# EAGLE design M307-9601 (EAGLE 6.6.0)
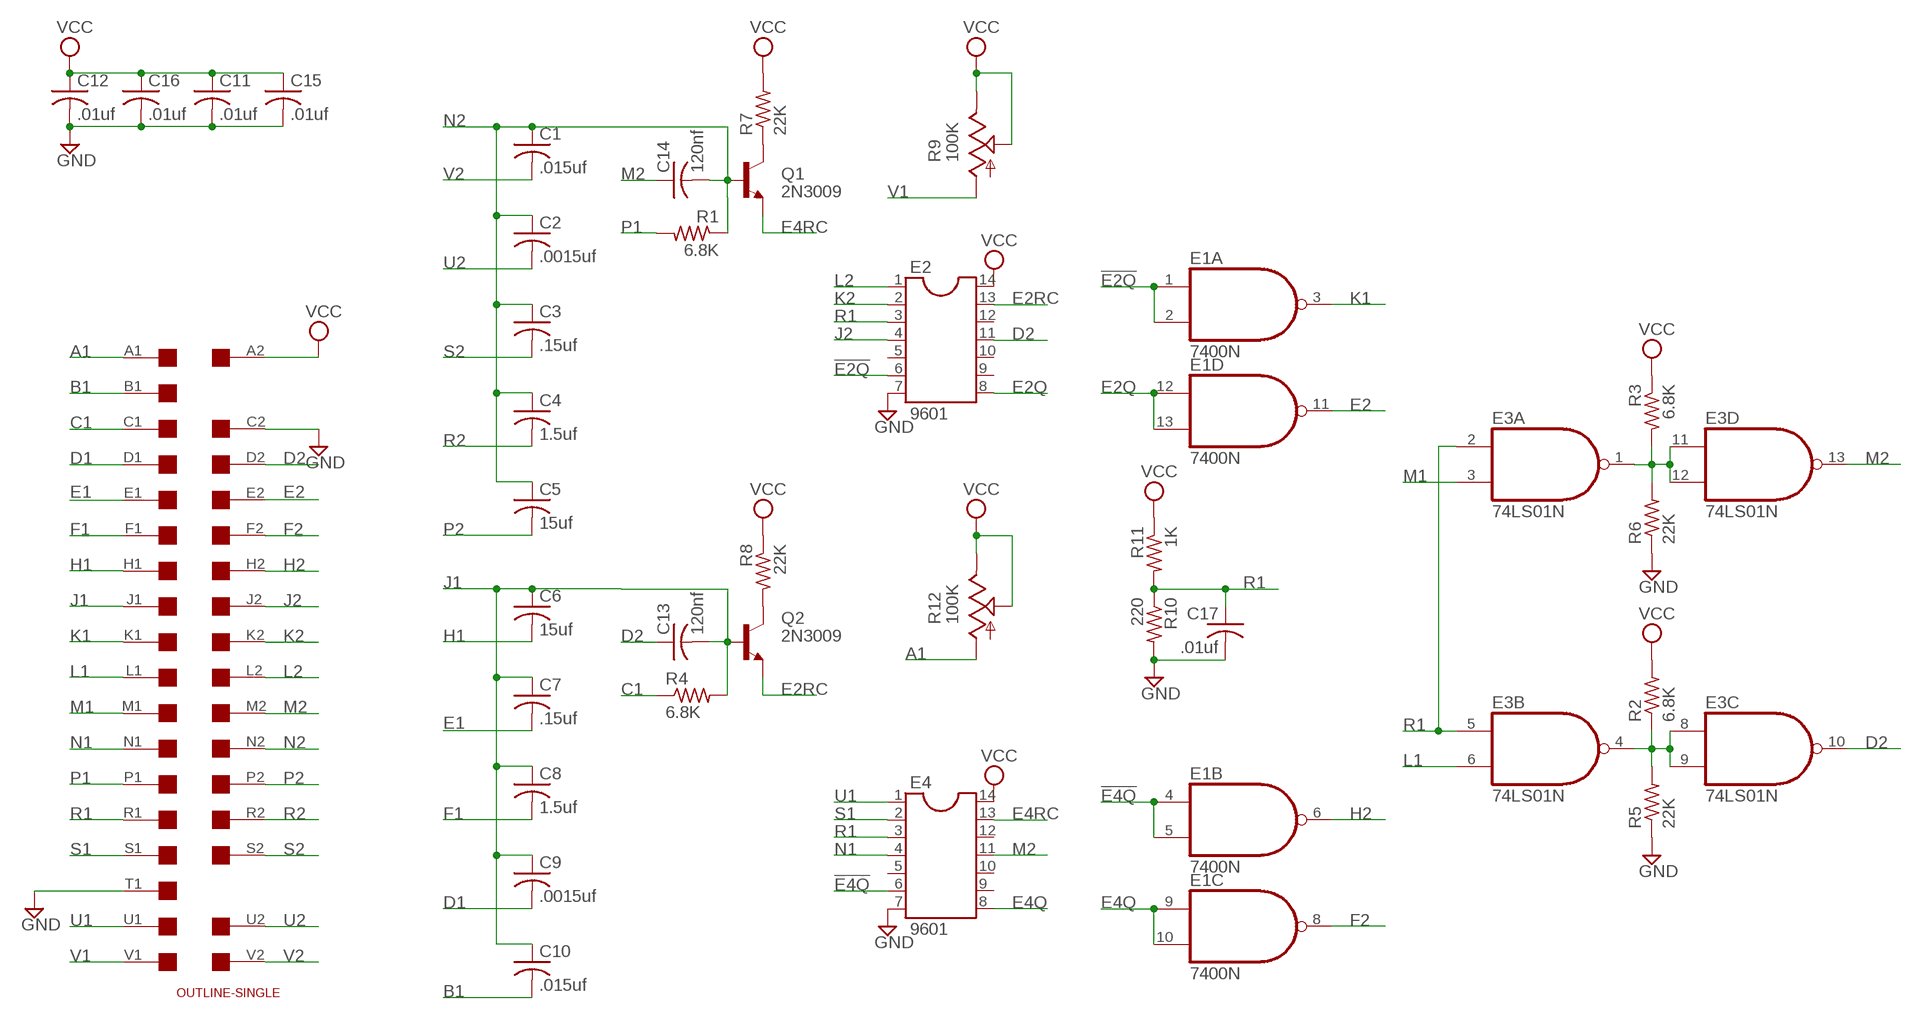
[diagram p0: schematic, sheet 1]

## Parts
C1  .015uf  C-US150-054X183  [C150-054X183]
C2  .0015uf  C-US050-025X075  [C050-025X075]
C3  .15uf  C-US102-043X133  [C102-043X133]
C4  1.5uf  C-US150-054X183  [C150-054X183]
C5  15uf  C-US150-054X183  [C150-054X183]
C6  15uf  C-US150-054X183  [C150-054X183]
C7  .15uf  C-US102-043X133  [C102-043X133]
C8  1.5uf  C-US150-054X183  [C150-054X183]
C9  .0015uf  C-US050-025X075  [C050-025X075]
C10  .015uf  C-US150-054X183  [C150-054X183]
C11  .01uf  C-US050-025X075  [C050-025X075]
C12  .01uf  C-US050-025X075  [C050-025X075]
C13  120nf  C-US075-032X103  [C075-032X103]
C14  120nf  C-US075-032X103  [C075-032X103]
C15  .01uf  C-US050-025X075  [C050-025X075]
C16  .01uf  C-US050-025X075  [C050-025X075]
C17  .01uf  C-US050-025X075  [C050-025X075]
E1  7400N  [DIL14]
E2  9601  DIL14  [DIL14]
E3  74LS01N  [DIL14]
E4  9601  DIL14  [DIL14]
Q1  2N3009  2N3019-NPN-TO39-EBC  [TO39]
Q2  2N3009  2N3019-NPN-TO39-EBC  [TO39]
R1  6.8K  R-US_0207/10  [0207/10]
R2  6.8K  R-US_0207/10  [0207/10]
R3  6.8K  R-US_0207/10  [0207/10]
R4  6.8K  R-US_0207/10  [0207/10]
R5  22K  R-US_0207/10  [0207/10]
R6  22K  R-US_0207/10  [0207/10]
R7  22K  R-US_0207/10  [0207/10]
R8  22K  R-US_0207/10  [0207/10]
R9  100K  TRIM_US-PTSPIN  [PT-SPIN]
R10  220  R-US_0207/10  [0207/10]
R11  1K  R-US_0207/10  [0207/10]
R12  100K  TRIM_US-PTSPIN  [PT-SPIN]
U$1  OUTLINE-SINGLE  [SINGLE]
U$4  SINGLE  [EDGE-CON2]

## Nets
!E2Q: E1.1(A:I0) E1.2(A:I1) E2.6
!E4Q: E1.4(B:I0) E1.5(B:I1) E4.6
A1: R12.A U$4.A1
B1: C10.2 U$4.B1
C1: R4.1 U$4.C1
D1: C9.2 U$4.D1
D2: C13.1 E2.11 E3.10(C:O) U$4.D2
E1: C7.2 U$4.E1
E2: E1.11(D:O) U$4.E2
E2Q: E1.12(D:I0) E1.13(D:I1) E2.8
E2RC: E2.13 Q2.1(E)
E4Q: E1.9(C:I0) E1.10(C:I1) E4.8
E4RC: E4.13 Q1.1(E)
F1: C8.2 U$4.F1
F2: E1.8(C:O) U$4.F2
GND [power]: C11.2 C12.2 C15.2 C16.2 C17.2 E2.7 E4.7 R5.1 R6.1 R10.2 U$4.C2 U$4.T1
H1: C6.2 U$4.H1
H2: E1.6(B:O) U$4.H2
J1: C6.1 C7.1 C8.1 C9.1 C10.1 C13.2 Q2.2(B) R4.2 U$4.J1
J2: E2.4 U$4.J2
K1: E1.3(A:O) U$4.K1
K2: E2.2 U$4.K2
L1: E3.6(B:I1) U$4.L1
L2: E2.1 U$4.L2
M1: E3.3(A:I1) U$4.M1
M2: C14.1 E3.13(D:O) E4.11 U$4.M2
N1: E4.4 U$4.N1
N2: C1.1 C2.1 C3.1 C4.1 C5.1 C14.2 Q1.2(B) R1.1 U$4.N2
N$1: Q1.3(C) R7.1
N$2: E3.4(B:O) E3.8(C:I0) E3.9(C:I1) R2.1 R5.2
N$3: Q2.3(C) R8.2
N$5: E3.1(A:O) E3.11(D:I0) E3.12(D:I1) R3.2 R6.2
P1: R1.2 U$4.P1
P2: C5.2 U$4.P2
R1: C17.1 E2.3 E3.2(A:I0) E3.5(B:I0) E4.3 R10.1 R11.2 U$4.R1
R2: C4.2 U$4.R2
S1: E4.2 U$4.S1
S2: C3.2 U$4.S2
U1: E4.1 U$4.U1
U2: C2.2 U$4.U2
V1: R9.A U$4.V1
V2: C1.2 U$4.V2
VCC [power]: C11.1 C12.1 C15.1 C16.1 E2.14 E4.14 R2.2 R3.1 R7.2 R8.1 R9.E R9.S R11.1 R12.E R12.S U$4.A2
Unconnected: E2.5 E2.9 E2.10 E2.12 E4.5 E4.9 E4.10 E4.12 U$4.B2 U$4.T2

## Power pins joined to a net without a drawn wire
GND: E1.7(P:GND) E3.7(P:GND)
VCC: E1.14(P:VCC) E3.14(P:VCC)

## Library data of the parts
C1-C17 = rcl:C-US: CAPACITOR, American symbol
E1 = 74xx-us:74*00: Quad 2-input NAND gate
E2 E4 = ic-package:DIL14: Dual In Line / Socket
E3 = 74xx-us:74*01: Quad 2-input NAND gate, open collector
Q1 Q2 = transistor:*-NPN-: NPN Transistror BF959 corrected 2008.03.06
R1-R8 R10 R11 = rcl:R-US_: RESISTOR, American symbol
R9 R12 = pot:TRIM_US-: POTENTIOMETER
U$1 = dec-con:OUTLINE-*: Board outlines for DEC boards.
U$4 = dec-con:SINGLE: Single-Height DEC board

## Net classes
1 power: width 0.508 mm, clearance 0.508 mm

## Board
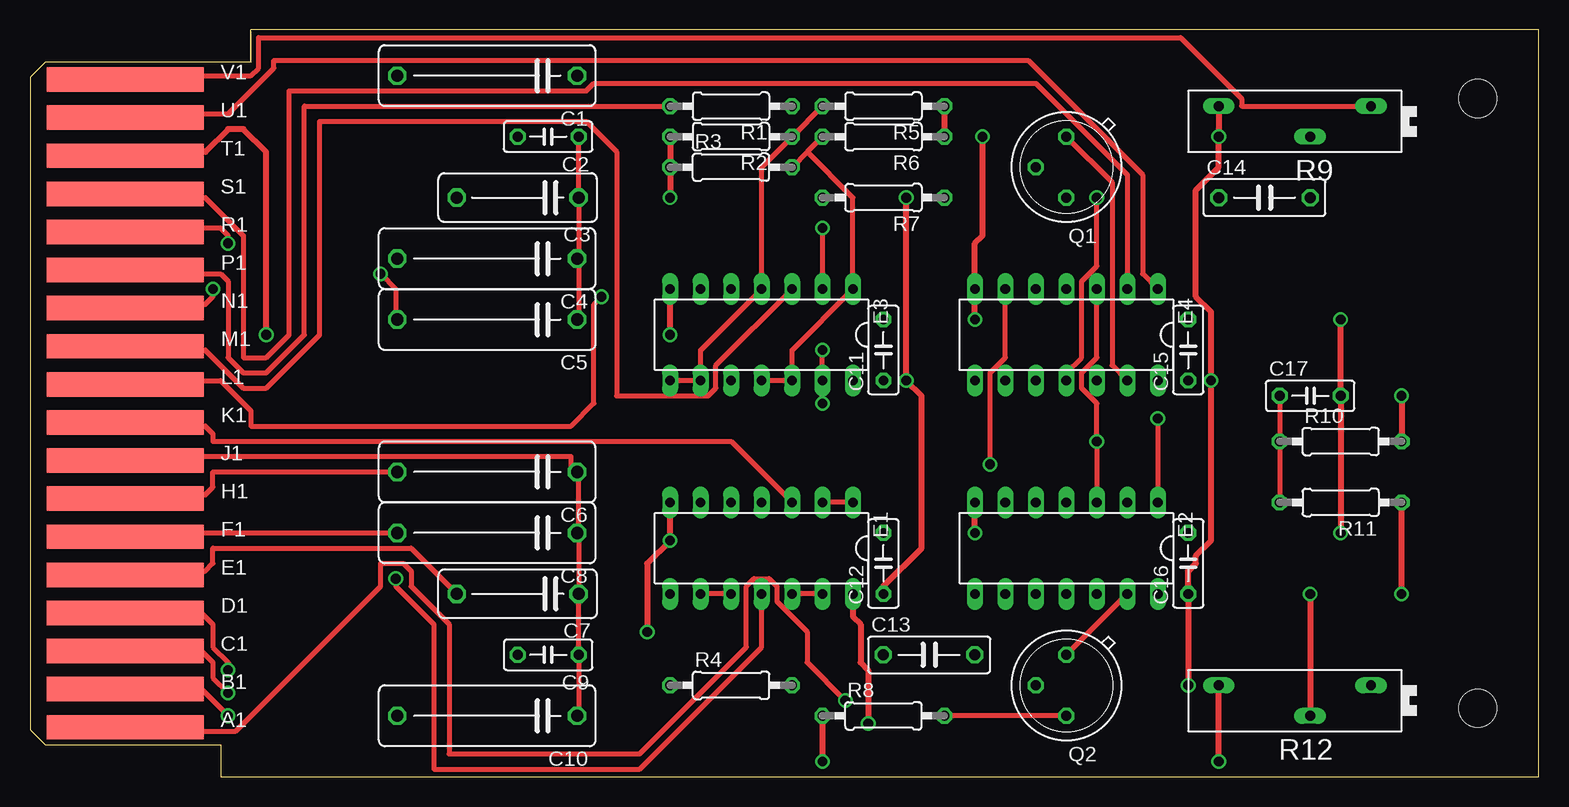
[diagram p1: board, top side]
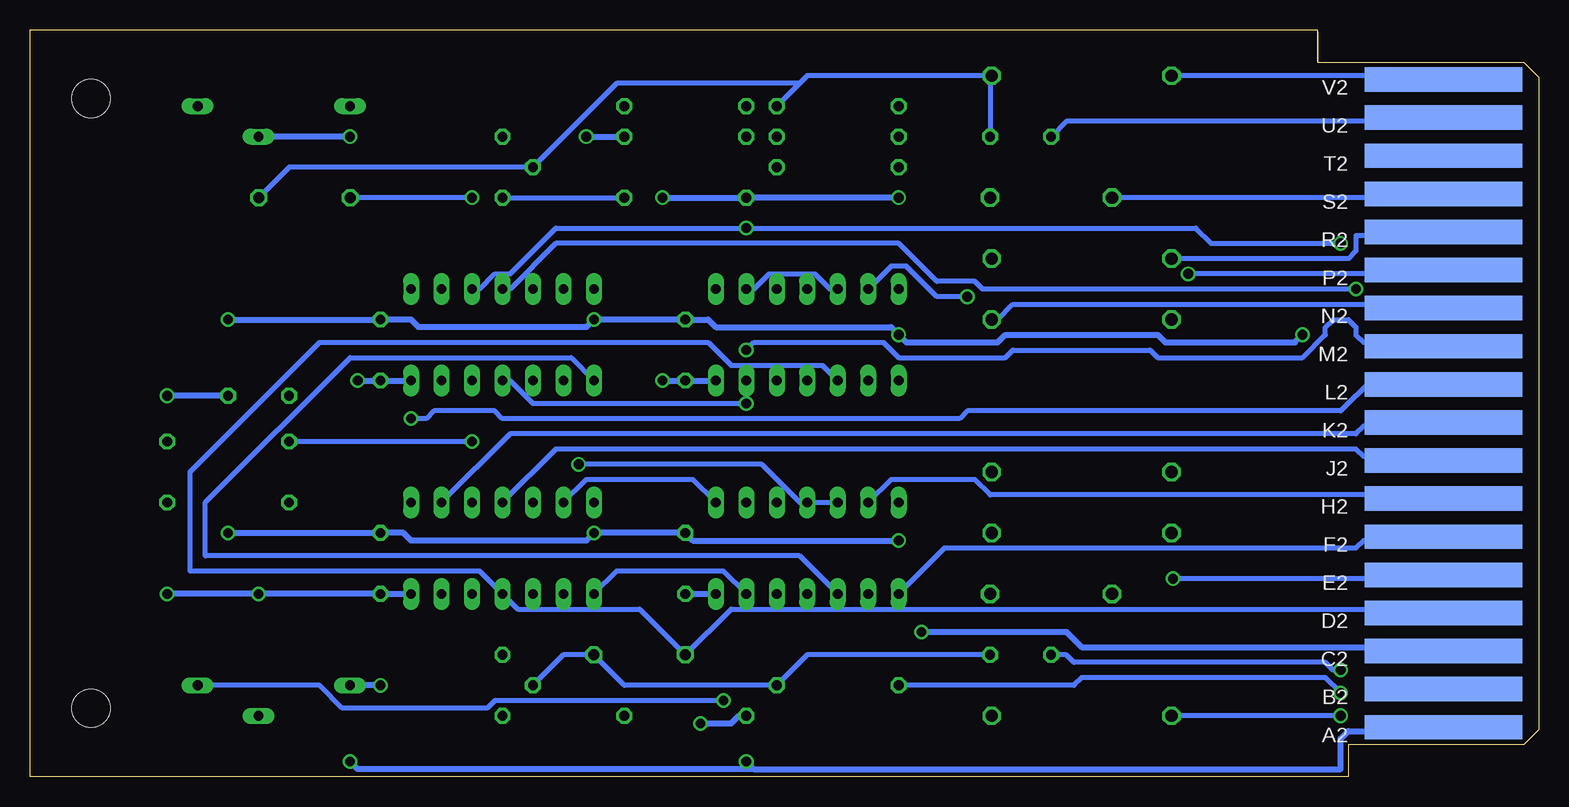
[diagram p2: board, bottom side, seen from below]

Size 125.73 x 62.23 mm. Coordinates in mm from the lower left corner, seen from the top.
Copper layers (1+16): Top 0.035mm / dielectric 1.5mm / Bottom 0.035mm
Design rules "16mils": minimum track width 16mil, minimum drill 32mil, track to track 15mil, track to pad 10mil, pad to pad 10mil, via to via 10mil, smd to smd 10mil, copper to edge 13mil, drill to drill 10mil, minimum pad ring 10mil, minimum via ring 8mil, stop-mask expansion 0mil, vias tented up to drill 0mil, thermal gap 10mil

### Footprints (pad centres in the part's own frame; a part is rotated, then mirrored left to right if it is on the bottom)
C150-054X183 = drill 1.016 octagon: 1 -7.493,0; 2 7.493,0
C050-025X075 = drill 0.813 octagon: 1 -2.54,0; 2 2.54,0
C102-043X133 = drill 1.016 octagon: 1 -5.08,0; 2 5.08,0
C075-032X103 = drill 0.914 octagon: 1 -3.81,0; 2 3.81,0
DIL14 = drill 0.813 long: 1 -7.62,-3.81; 2 -5.08,-3.81; 3 -2.54,-3.81; 4 0,-3.81; 5 2.54,-3.81; 6 5.08,-3.81; 7 7.62,-3.81; 8 7.62,3.81; 9 5.08,3.81; 10 2.54,3.81; 11 0,3.81; 12 -2.54,3.81; 13 -5.08,3.81; 14 -7.62,3.81
TO39 = drill 0.813 octagon: 1 0,-2.54; 2 2.54,0; 3 0,2.54
0207/10 = drill 0.813 octagon: 1 -5.08,0; 2 5.08,0
PT-SPIN = drill 0.813 long: A -6.35,-1.27; E 6.35,-1.27; S -1.27,1.27
SINGLE = hole 3.175: 120.65,56.515; 120.65,5.715
EDGE-CON2 = smd 13.106 x 2.032: A1 7.938,4.128; B1 7.938,7.303; C1 7.938,10.477; D1 7.938,13.652; E1 7.938,16.828; F1 7.938,20.003; H1 7.938,23.177; J1 7.938,26.352; K1 7.938,29.527; L1 7.938,32.703; M1 7.938,35.877; N1 7.938,39.053; P1 7.938,42.227; R1 7.938,45.403; S1 7.938,48.578; T1 7.938,51.752; U1 7.938,54.928; V1 7.938,58.102 | smd 13.106 x 2.032 bottom: A2 7.938,4.128; B2 7.938,7.303; C2 7.938,10.477; D2 7.938,13.652; E2 7.938,16.828; F2 7.938,20.003; H2 7.938,23.177; J2 7.938,26.352; K2 7.938,29.527; L2 7.938,32.703; M2 7.938,35.877; N2 7.938,39.053; P2 7.938,42.227; R2 7.938,45.403; S2 7.938,48.578; T2 7.938,51.752; U2 7.938,54.928; V2 7.938,58.102

### Placement (x,y rotation side)
C1  38.1,58.42 180 top
C2  43.18,53.34 180 top
C3  40.64,48.26 180 top
C4  38.1,43.18 180 top
C5  38.1,38.1 180 top
C6  38.1,25.4 180 top
C7  40.64,15.24 180 top
C8  38.1,20.32 180 top
C9  43.18,10.16 180 top
C10  38.1,5.08 180 top
C11  71.12,35.56 90 top
C12  71.12,17.78 90 top
C13  74.93,10.16 0 top
C14  102.87,48.26 0 top
C15  96.52,35.56 90 top
C16  96.52,17.78 90 top
C17  106.68,31.75 0 top
E1  60.96,19.05 180 top
E2  86.36,19.05 180 top
E3  60.96,36.83 180 top
E4  86.36,36.83 180 top
Q1  86.36,50.8 180 top
Q2  86.36,7.62 180 top
R1  58.42,55.88 180 top
R2  58.42,53.34 180 top
R3  58.42,50.8 0 top
R4  58.42,7.62 0 top
R5  71.12,55.88 180 top
R6  71.12,53.34 180 top
R7  71.12,48.26 180 top
R8  71.12,5.08 0 top
R9  105.41,54.61 180 top
R10  109.22,27.94 0 top
R11  109.22,22.86 180 top
R12  105.41,6.35 180 top
U$1  0,0 0 top
U$4  0,0 0 top

### Tracks (layer width: path | path; a pad name or v marks a point on that pad's centre or on a via)
!E2Q
  Top 0.406: E1.1 E1.2
  Bottom 0.406: E2.6 79.38,24.77 70.49,24.77 E1.1
!E4Q  (via drill 0.81)
  Top 0.406: E4.6 81.28,34.92 80.01,33.66 v80.01,26.04
  Bottom 0.406: E1.5 E1.4 61.6,22.86 64.77,26.04 v80.01,26.04
A1  (via drill 0.81)
  Top 0.406: v67.95,6.35 64.77,9.53 64.77,12.06 62.23,14.61 62.23,15.88 61.6,16.51 60.33,16.51 59.69,15.88 59.69,10.79 50.8,1.91 34.93,1.91 34.93,12.7 31.75,15.88 31.75,17.14 31.12,17.78 29.21,17.78 29.21,15.88 17.15,3.81 9.53,3.81 8.89,4.45 8.26,4.45 U$4.A1
  Bottom 0.406: R12.A 101.6,7.62 99.7,5.71 87.63,5.71 87,6.35 v67.95,6.35
B1  (via drill 0.81)
  Top 0.406: v16.51,5.08 13.97,7.62 8.26,7.62 U$4.B1
  Bottom 0.406: v16.51,5.08 C10.2
C1  (via drill 0.81)
  Top 0.406: v16.51,6.99 15.24,8.26 15.24,9.53 13.97,10.79 8.26,10.79 U$4.C1
  Bottom 0.406: R4.1 38.74,7.62 38.1,8.26 17.78,8.26 v16.51,6.99
D1  (via drill 0.81)
  Top 0.406: v16.51,8.89 16.51,9.53 15.24,10.79 15.24,12.7 13.97,13.97 8.26,13.97 U$4.D1
  Bottom 0.406: C9.2 39.37,10.16 38.74,9.53 17.78,9.53 17.15,8.89 v16.51,8.89
D2
  Bottom 0.406: E3.10 59.69,34.29 67.31,34.29 69.22,36.2 101.6,36.2 112.4,25.4 112.4,17.14 88.27,17.14 E2.11 85.09,13.97 74.93,13.97 C13.1 67.31,13.97 8.26,13.97 U$4.D2
E1
  Top 0.406: C7.2 31.75,19.05 15.24,19.05 15.24,17.78 14.61,17.14 8.26,17.14 U$4.E1
E2  (via drill 0.81)
  Top 0.406: E1.11 60.96,10.79 50.8,0.64 33.66,0.64 33.66,12.7 30.48,15.88 v30.48,16.51
  Bottom 0.406: v30.48,16.51 12.07,16.51 11.43,17.14 8.26,17.14 U$4.E2
E2Q
  Top 0.406: E1.13 E1.12
  Bottom 0.406: E2.8 76.84,17.14 67.95,17.14 E1.13
E2RC
  Top 0.406: E2.13 Q2.1
E4Q
  Top 0.406: E1.10 E1.9
  Bottom 0.406: E4.8 80.65,34.92 99.06,34.92 111.13,22.86 111.13,18.41 61.6,18.41 E1.10
E4RC
  Top 0.406: E4.13 90.17,34.29 90.17,49.53 Q1.1
F1
  Top 0.406: C8.2 8.26,20.32 U$4.F1
F2
  Bottom 0.406: E1.8 49.53,19.05 15.24,19.05 14.61,19.68 8.26,19.68 U$4.F2
GND  (via drill 0.81)
  Top 0.508: E1.7 v53.34,19.68 51.44,17.78 v51.44,12.06 | v78.74,20.32 E2.7 | v114.3,31.75 R10.2 | v109.22,38.1 C17.2 v109.22,20.32 | R5.1 R6.1 | v78.74,38.1 E4.7 78.74,44.45 79.38,45.09 v79.38,53.34 | v53.34,36.83 E3.7 | v19.69,36.83 19.69,52.07 17.78,53.98 16.51,53.98 14.61,52.07 8.26,52.07 U$4.T1
  Bottom 0.508: v53.34,19.68 70.49,19.68 C12.2 v78.74,20.32 79.38,19.68 93.98,19.68 94.62,20.32 C16.2 v109.22,20.32 | v51.44,12.06 39.37,12.06 38.1,10.79 8.26,10.79 U$4.C2 | C17.2 v114.3,31.75 | v109.22,38.1 C15.2 93.98,38.1 93.35,37.47 79.38,37.47 v78.74,38.1 C11.2 69.22,38.1 68.58,37.47 53.98,37.47 v53.34,36.83 52.71,36.2 45.09,36.2 44.45,36.83 31.75,36.83 31.12,36.2 20.32,36.2 v19.69,36.83 | v79.38,53.34 R6.1
H1
  Top 0.406: C6.2 15.24,25.4 15.24,24.13 14.61,23.5 8.26,23.5 U$4.H1
H2
  Bottom 0.406: E1.6 53.98,24.77 46.99,24.77 45.72,23.5 8.26,23.5 U$4.H2
J1
  Top 0.406: 45.72,20.32 C7.1 C9.1 45.72,5.08 C10.1 | 45.72,20.32 45.72,25.4 C6.1 45.09,25.4 45.09,26.67 8.26,26.67 U$4.J1 | 45.72,20.32 C8.1
  Bottom 0.406: Q2.2 81.28,10.16 C13.2 76.2,7.62 R4.2 60.96,10.16 C9.1
J2
  Bottom 0.406: E2.4 81.92,27.3 15.24,27.3 14.61,26.67 8.26,26.67 U$4.J2
K1
  Top 0.406: E1.3 58.42,27.94 15.24,27.94 15.24,28.57 14.61,29.21 8.26,29.21 U$4.K1
K2
  Bottom 0.406: E2.2 85.73,28.57 15.24,28.57 14.61,29.21 8.26,29.21 U$4.K2
L1  (via drill 0.81)
  Top 0.406: v47.63,40.01 46.99,39.37 46.99,31.11 45.09,29.21 18.42,29.21 18.42,30.48 15.88,33.02 8.26,33.02 U$4.L1
  Bottom 0.406: E3.6 53.98,42.55 52.71,42.55 50.17,40.01 v47.63,40.01
L2  (via drill 0.81)
  Top 0.406: v93.98,29.84 E2.1
  Bottom 0.406: v93.98,29.84 92.71,29.84 92.08,30.48 87,30.48 86.36,29.84 48.26,29.84 47.63,30.48 16.51,30.48 13.97,33.02 8.26,33.02 U$4.L2
M1
  Top 0.406: E3.3 57.15,34.29 57.15,32.38 56.52,31.75 48.9,31.75 48.9,52.07 46.36,54.61 24.13,54.61 24.13,36.83 19.69,32.38 17.78,32.38 14.61,35.56 8.26,35.56 U$4.M1
M2  (via drill 0.81)
  Top 0.406: v66.04,31.11 E3.13 v66.04,35.56 | v88.9,48.26 88.9,42.55 87.63,41.27 87.63,34.92 86.36,33.66 E4.11
  Bottom 0.406: v66.04,31.11 83.82,31.11 85.73,33.02 E4.11 | v88.9,48.26 C14.1 | v66.04,35.56 65.41,36.2 54.61,36.2 53.34,34.92 44.45,34.92 43.82,35.56 32.39,35.56 31.75,34.92 19.69,34.92 17.78,36.83 17.78,37.47 17.15,38.1 15.88,38.1 15.24,37.47 15.24,36.83 14.61,36.2 8.26,36.2 U$4.M2
N1  (via drill 0.81)
  Top 0.406: v15.24,40.64 15.24,40.01 14.61,39.37 8.26,39.37 U$4.N1
  Bottom 0.406: E4.4 85.73,40.64 81.92,44.45 53.34,44.45 50.17,41.27 46.99,41.27 46.36,40.64 v15.24,40.64
N2
  Top 0.406: 45.72,43.18 45.72,38.1 C5.1 | C2.1 C3.1 45.72,43.18 | 45.72,43.18 C4.1
  Bottom 0.406: 61.6,57.78 60.96,58.42 45.72,58.42 | 61.6,57.78 R1.1 | 61.6,57.78 76.84,57.78 Q1.2 104.14,50.8 C14.2 | 45.72,58.42 C2.1 | 45.72,58.42 C1.1 | U$4.N2 8.26,39.37 43.82,39.37 45.09,38.1 C5.1
N$1
  Bottom 0.406: Q1.3 R7.1
N$2
  Top 0.406: R5.2 R2.1 60.96,50.8 E3.4 55.88,35.56 E3.9 E3.8
N$3
  Top 0.406: Q2.3 R8.2
N$5
  Top 0.406: R6.2 64.77,52.07 | 64.77,52.07 R3.2 | E3.11 E3.12 63.5,35.56 E3.1 68.58,48.26 64.77,52.07
P1
  Top 0.406: R1.2 22.86,55.88 22.86,36.83 19.69,33.66 17.78,33.66 16.51,34.92 16.51,41.27 15.88,41.91 8.26,41.91 U$4.P1
P2  (via drill 0.81)
  Top 0.406: v29.21,41.91 30.48,40.64 30.48,38.1 C5.2
  Bottom 0.406: v29.21,41.91 12.07,41.91 11.43,42.55 8.26,42.55 U$4.P2
R1  (via drill 0.81)
  Top 0.406: C17.1 R10.1 R11.2 | E2.3 v88.9,27.94 88.9,31.11 87.63,32.38 87.63,33.66 88.9,34.92 E4.3 | v66.04,45.72 E3.2 | v16.51,44.45 16.51,45.09 15.88,45.72 8.26,45.72 U$4.R1
  Bottom 0.406: E3.5 59.06,40.64 60.33,41.91 64.14,41.91 65.41,40.64 E3.2 | R10.1 v88.9,27.94 | E4.3 88.27,40.64 87,41.91 85.73,41.91 81.92,45.72 v66.04,45.72 28.58,45.72 27.31,44.45 v16.51,44.45
R2
  Bottom 0.406: C4.2 15.88,43.18 15.24,43.81 15.24,45.09 8.26,45.09 U$4.R2
S1
  Top 0.406: E4.2 91.44,50.16 83.82,57.78 46.99,57.78 46.36,57.15 21.59,57.15 21.59,36.83 19.69,34.92 17.78,34.92 17.78,45.09 14.61,48.26 8.26,48.26 U$4.S1
S2
  Bottom 0.406: C3.2 8.26,48.26 U$4.S2
U1
  Top 0.406: E4.1 92.71,41.91 92.71,50.16 83.19,59.69 20.32,59.69 20.32,59.05 16.51,55.24 8.26,55.24 U$4.U1
U2
  Bottom 0.406: C2.2 39.37,54.61 8.26,54.61 U$4.U2
V1
  Top 0.406: R9.A 100.97,55.88 100.97,56.52 95.89,61.59 19.05,61.59 19.05,59.05 18.42,58.42 8.26,58.42 U$4.V1
V2
  Bottom 0.406: C1.2 8.26,58.42 U$4.V2
VCC  (via drill 0.81)
  Top 0.508: R9.E v99.06,53.34 99.06,50.8 97.16,48.9 97.16,40.01 98.43,38.73 v98.43,33.02 98.43,19.68 97.16,18.41 97.16,17.78 96.52,17.14 C16.1 v96.52,7.62 | v114.3,15.24 R11.1 | v106.68,15.24 R12.S | R2.2 R3.1 v53.34,48.26 | v69.85,4.45 69.85,8.89 69.22,9.53 69.22,12.7 68.58,13.34 E1.14 | C12.1 71.12,15.88 74.3,19.05 74.3,31.75 v73.03,33.02 v73.03,48.26 | R8.1 v66.04,1.27 | v99.06,1.27 R12.E
  Bottom 0.508: v99.06,53.34 R9.S | E4.14 C15.1 v98.43,33.02 | E2.14 C16.1 v106.68,15.24 v114.3,15.24 | v96.52,7.62 R12.E | v53.34,48.26 R7.2 v73.03,48.26 | E3.14 C11.1 v73.03,33.02 | C12.1 E1.14 | R8.1 66.68,5.08 67.31,4.45 v69.85,4.45 | 65.41,0.64 16.51,0.64 16.51,3.17 15.88,3.81 8.26,3.81 U$4.A2 | v66.04,1.27 65.41,0.64 | v99.06,1.27 98.43,0.64 65.41,0.64